# EAGLE design HydraBus_1_0_Rev1_2plus (EAGLE 7.1.0)
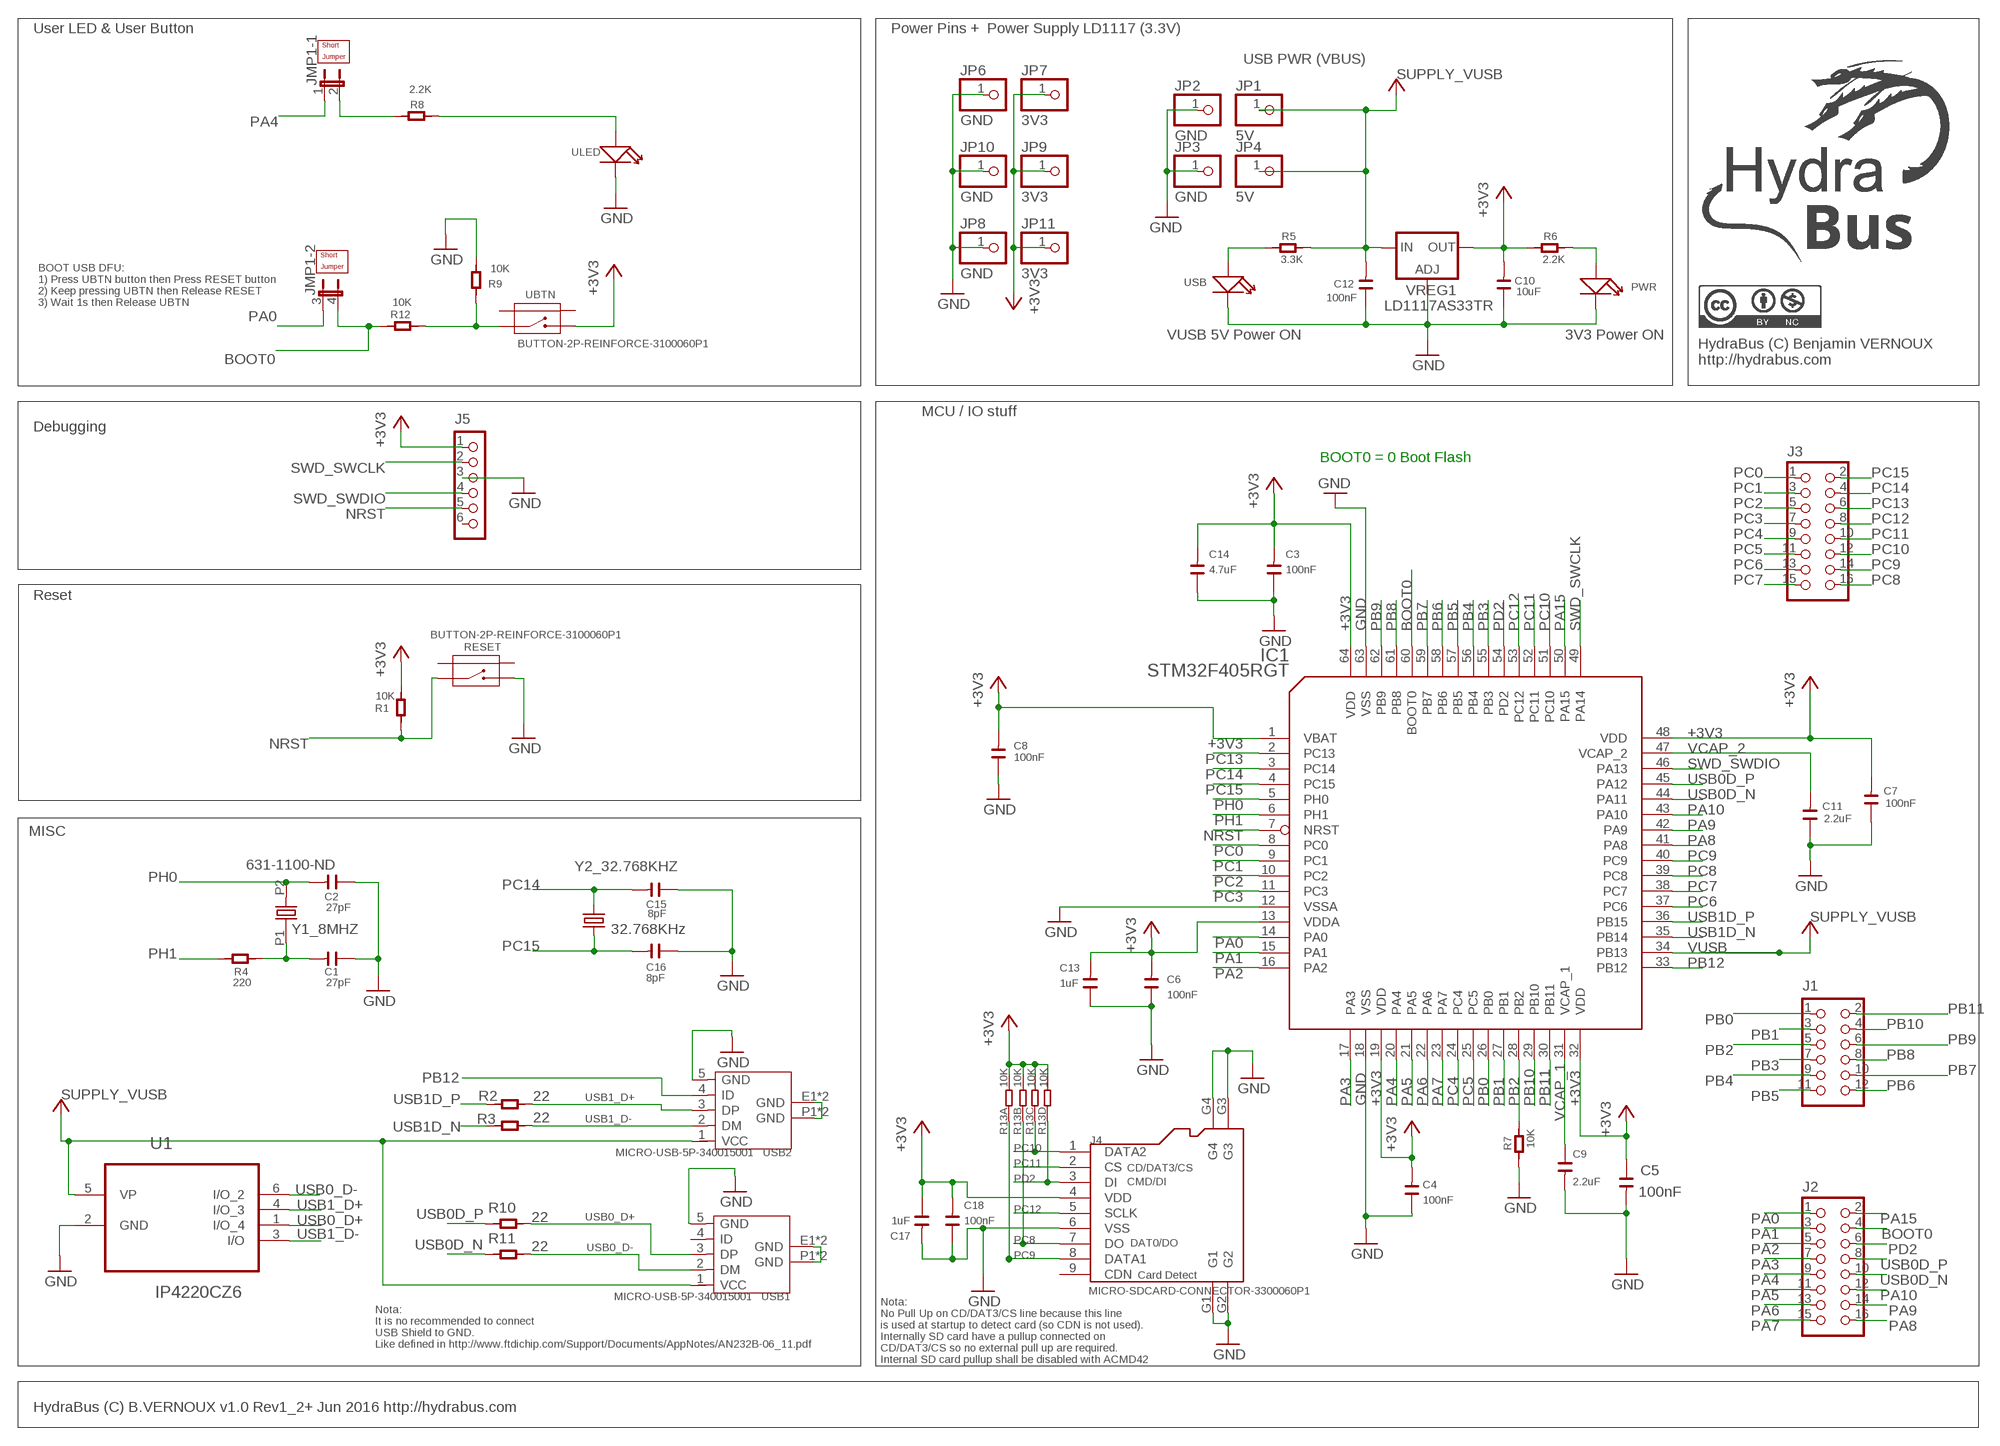
[diagram p0: schematic, sheet 1]

## Parts
C1  27pF  C-0603  [C0603]
C2  27pF  C-0603  [C0603]
C3  100nF  C-0603  [C0603]
C4  100nF  C-0603  [C0603]
C5  100nF  C-0603  [C0603]
C6  100nF  C-0603  [C0603]
C7  100nF  C-0603  [C0603]
C8  100nF  C-0603  [C0603]
C9  2.2uF  C-0603  [C0603]
C10  10uF  C-0805  [C0805]
C11  2.2uF  C-0603  [C0603]
C12  100nF  C-0603  [C0603]
C13  1uF  C-0603  [C0603]
C14  4.7uF  C-0603  [C0603]
C15  8pF  C-0603  [C0603]
C16  8pF  C-0603  [C0603]
C17  1uF  C-0603  [C0603]
C18  100nF  C-0603  [C0603]
IC1  STM32F405RGT  [LQFP64]
J1  CON_HEADER_2X06  [M2X6]
J2  CON_HEADER_2X08  [M2X8]
J3  CON_HEADER_2X08  [M2X8]
J4  MICRO-SDCARD-CONNECTOR-3300060P1  [9P-SMD-W-RING]
J5  CON_HEADER_1X06-PTH  [M1X6]
JMP1  JP2QE  [JP2Q]
JMP_UBTN  SHORT-JUMPER-2P-3460440P1  [2P-2.54]
JMP_ULED  SHORT-JUMPER-2P-3460440P1  [2P-2.54]
JP1  5V  PINHD-1X1  [1X01]
JP2  GND  PINHD-1X1  [1X01]
JP3  GND  PINHD-1X1  [1X01]
JP4  5V  PINHD-1X1  [1X01]
JP6  GND  PINHD-1X1  [1X01]
JP7  3V3  PINHD-1X1  [1X01]
JP8  GND  PINHD-1X1  [1X01]
JP9  3V3  PINHD-1X1  [1X01]
JP10  GND  PINHD-1X1  [1X01]
JP11  3V3  PINHD-1X1  [1X01]
PWR  LED  [LED0603]
R1  10K  R-0603  [R0603]
R2  22  R-0603  [R0603]
R3  22  R-0603  [R0603]
R4  220  R-0603  [R0603]
R5  3.3K  R-0603  [R0603]
R6  2.2K  R-0603  [R0603]
R7  10K  R-0603  [R0603]
R8  2.2K  R-0603  [R0603]
R9  10K  R-0603  [R0603]
R10  22  R-0603  [R0603]
R11  22  R-0603  [R0603]
R12  10K  R-0603  [R0603]
R13  10K  R-4R  [R1206-8]
RESET  BUTTON-2P-REINFORCE-3100060P1  [4P-SMD-7.0X3.5X3.5H-90D]
U1  IP4220CZ6  [SOT95P275X110-6N]
UBTN  BUTTON-2P-REINFORCE-3100060P1  [4P-SMD-7.0X3.5X3.5H-90D]
ULED  LED  [LED0603]
USB  LED  [LED0603]
USB1  MICRO-USB-5P-340015001  [B-SMD-5P]
USB2  MICRO-USB-5P-340015001  [B-SMD-5P]
VREG1  LD1117AS33TR  LD117AS33TR  [SOT223]
Y1_8MHZ  631-1100-ND  OSC-XTAL-HC-49U-PTH  [HC-49U-PTH]
Y2_32.768KHZ  32.768KHz  CRYSTALTC38H  [TC38H]

## Nets
+3V3 [VDD]: C3.1 C4.1 C5.2 C6.1 C7.1 C8.1 C10.1 C13.1 C14.1 C17.2 C18.1 IC1.1(VBAT) IC1.13(VDDA) IC1.19(VDD) IC1.32(VDD) IC1.48(VDD) IC1.64(VDD) J4.4(VDD) J5.1 JP7.1 JP9.1 JP11.1 R1.2 R6.2 R13.5 R13.6 R13.7 R13.8 UBTN.2 VREG1.4(OUT)
BOOT0: IC1.60(BOOT0) J2.4 JMP1.4 R12.2
GND: C1.2 C2.2 C3.2 C4.2 C5.1 C6.2 C7.2 C8.2 C9.1 C10.2 C11.2 C12.2 C13.2 C14.2 C15.2 C16.2 C17.1 C18.2 IC1.12(VSSA) IC1.18(VSS) IC1.63(VSS) J4.6(VSS) J4.G1 J4.G2 J4.G3 J4.G4 J5.3 JP2.1 JP3.1 JP6.1 JP8.1 JP10.1 PWR.- R7.2 R9.2 RESET.2 U1.2(GND) ULED.- USB1.5(GND) USB2.5(GND) USB.- VREG1.1(ADJ)
N$1: C1.1 R4.1 Y1_8MHZ.P1
N$4: JMP1.2 R8.2
N$6: R9.1 R12.1 UBTN.1
N$7: R8.1 ULED.+
N$10: USB2.E1(GND) USB2.E2(GND) USB2.P1(GND) USB2.P2(GND)
N$11: USB1.E1(GND) USB1.E2(GND) USB1.P1(GND) USB1.P2(GND)
N$32: R5.2 USB.+
N$33: PWR.+ R6.1
NRST: IC1.7(NRST) J5.5 R1.1 RESET.1
PA0: IC1.14(PA0) J2.1 JMP1.3
PA1: IC1.15(PA1) J2.3
PA2: IC1.16(PA2) J2.5
PA3: IC1.17(PA3) J2.7
PA4: IC1.20(PA4) J2.9 JMP1.1
PA5: IC1.21(PA5) J2.11
PA6: IC1.22(PA6) J2.13
PA7: IC1.23(PA7) J2.15
PA8: IC1.41(PA8) J2.16
PA9: IC1.42(PA9) J2.14
PA10: IC1.43(PA10) J2.12
PA15: IC1.50(PA15) J2.2
PB0: IC1.26(PB0) J1.1
PB1: IC1.27(PB1) J1.3
PB2: IC1.28(PB2) J1.5 R7.1
PB3: IC1.55(PB3) J1.7
PB4: IC1.56(PB4) J1.9
PB5: IC1.57(PB5) J1.11
PB6: IC1.58(PB6) J1.12
PB7: IC1.59(PB7) J1.10
PB8: IC1.61(PB8) J1.8
PB9: IC1.62(PB9) J1.6
PB10: IC1.29(PB10) J1.4
PB11: IC1.30(PB11) J1.2
PB12: IC1.33(PB12) USB2.4(ID)
PC0: IC1.8(PC0) J3.1
PC1: IC1.9(PC1) J3.3
PC2: IC1.10(PC2) J3.5
PC3: IC1.11(PC3) J3.7
PC4: IC1.24(PC4) J3.9
PC5: IC1.25(PC5) J3.11
PC6: IC1.37(PC6) J3.13
PC7: IC1.38(PC7) J3.15
PC8: IC1.39(PC8) J3.16 J4.7(DO) R13.2
PC9: IC1.40(PC9) J3.14 J4.8(DATA1) R13.1
PC10: IC1.51(PC10) J3.12 J4.1(DATA2) R13.3
PC11: IC1.52(PC11) J3.10 J4.2(CS)
PC12: IC1.53(PC12) J3.8 J4.5(SCLK)
PC13: IC1.2(PC13) J3.6
PC14: C15.1 IC1.3(PC14) J3.4 Y2_32.768KHZ.2
PC15: C16.1 IC1.4(PC15) J3.2 Y2_32.768KHZ.1
PD2: IC1.54(PD2) J2.6 J4.3(DI) R13.4
PH0: C2.1 IC1.5(PH0) Y1_8MHZ.P2
PH1: IC1.6(PH1) R4.2
SWD_SWCLK: IC1.49(PA14) J5.2
SWD_SWDIO: IC1.46(PA13) J5.4
USB0_D+: R10.1 U1.1(I/O_4) USB1.3(DP)
USB0_D-: R11.1 U1.6(I/O_2) USB1.2(DM)
USB0D_N: IC1.44(PA11) J2.10 R11.2
USB0D_P: IC1.45(PA12) J2.8 R10.2
USB1_D+: R2.1 U1.4(I/O_3) USB2.3(DP)
USB1_D-: R3.1 U1.3(I/O) USB2.2(DM)
USB1D_N: IC1.35(PB14) R3.2
USB1D_P: IC1.36(PB15) R2.2
VCAP_1: C9.2 IC1.31(VCAP_1)
VCAP_2: C11.1 IC1.47(VCAP_2)
VUSB [POWER]: C12.1 IC1.34(PB13) JP1.1 JP4.1 R5.1 U1.5(VP) USB1.1(VCC) USB2.1(VCC) VREG1.3(IN) ; supply symbol labelled SUPPLY_VUSB
Unconnected: J4.9(CDN) J5.6 RESET.S1 RESET.S2 UBTN.S1 UBTN.S2 USB1.4(ID)

## Notes on the sheet
- User LED & User Button | Power Pins +  Power Supply LD1117 (3.3V)
- USB PWR (VBUS)
- BOOT USB DFU:
  1) Press UBTN button then Press RESET button
  2) Keep pressing UBTN then Release RESET
  3) Wait 1s then Release UBTN
- VUSB 5V Power ON | 3V3 Power ON
- HydraBus (C) Benjamin VERNOUX
  http://hydrabus.com
- MCU / IO stuff
- Debugging
- BOOT0 = 0 Boot Flash
- Reset
- MISC
- CD/DAT3/CS
- CMD/DI
- DAT0/DO
- Card Detect
- Nota:
  It is no recommended to connect
  USB Shield to GND.
  Like defined in http://www.ftdichip.com/Support/Documents/AppNotes/AN232B-06_11.pdf
- Nota:
  No Pull Up on CD/DAT3/CS line because this line
  is used at startup to detect card (so CDN is not used).
  Internally SD card have a pullup connected on
  CD/DAT3/CS so no external pull up are required.
  Internal SD card pullup shall be disabled with ACMD42
- HydraBus (C) B.VERNOUX v1.0 Rev1_2+ Jun 2016 http://hydrabus.com

## Library data of the parts
C1-C18 = OPL:C*
IC1 = 0ben:STM32F405R*T: STM32F405R*T ARM Cortex-M4 32b MCU+FPU, 210DMIPS, up to 1MB Flash/192+4KB RAM, USB OTG HS/FS, 17 TIMs, 3 ADCs, 15 comm.
J1 = hydrabus:CON_HEADER_2X06: 2x5 Pin header
J2 J3 = hydrabus:CON_HEADER_2X08
J4 = OPL:MICRO-SDCARD-CONNECTOR: Micro SD Card
J5 = hydrabus:CON_HEADER_1X06
JMP1 = jumper:JP2QE: JUMPER
JMP_UBTN JMP_ULED = OPL:SHORT-JUMPER-2P
JP1-JP4 JP6-JP11 = pinhead:PINHD-1X1: PIN HEADER
PWR ULED USB = OPL:LED*: LED
R1 R9 = OPL:R*; OPL_REF: 0010170P1 10K-5%-1/10W R0603
R2 R3 R10 R11 = OPL:R*; OPL: 0010010P1 RC0603JR-0722RL SMD RES 22R-5%-1/10W
R4-R8 R12 = OPL:R*
R13 = OPL:R-4R*: Resistor Array; OPL: 0040070P1 SMD RES ARRAY 10K OHM 4 RES 1206
RESET UBTN = OPL:BUTTON-2P-REINFORCE: TS-1188E http://www.best-dz.com/?thread-374-2.html SMD Button
U1 = 0ben:IP4220CZ6: Dual Schmitt-Trigger Inverter; MPN: IP4220CZ6; OC_FARNELL: 1506629; OC_MOUSER: 771-IP4220CZ6-T/R; OC_NEWARK: 61M6815; PACKAGE: SSOT-6; SUPPLIER: NXP
USB1 USB2 = OPL:MICRO-USB-5P: ST-USB-001E：MICRO USB B SMD R/A
VREG1 = v-reg:LD117A?*: Low drop fixed and adjustable positive voltage regulators 1 A Source: http://www.st.com/stonline/products/literature/ds/7194/ld1117axx.pdf; OPL_REF: 1310190P1 CJT1117-3.3 SOT223
Y1_8MHZ = dp_devices:OSC-XTAL
Y2_32.768KHZ = SparkFun:CRYSTAL: Crystals Various standard crystals. Proven footprints. Spark Fun Electronics SKU : COM-00534

## Net classes
0 default: width 0.203 mm, drill 0.33 mm, clearance 0.152 mm
1 POWER: width 0.203 mm, drill 0.33 mm, clearance 0.152 mm
2 VDD: width 0.254 mm, drill 0.33 mm, clearance 0.152 mm

## Board
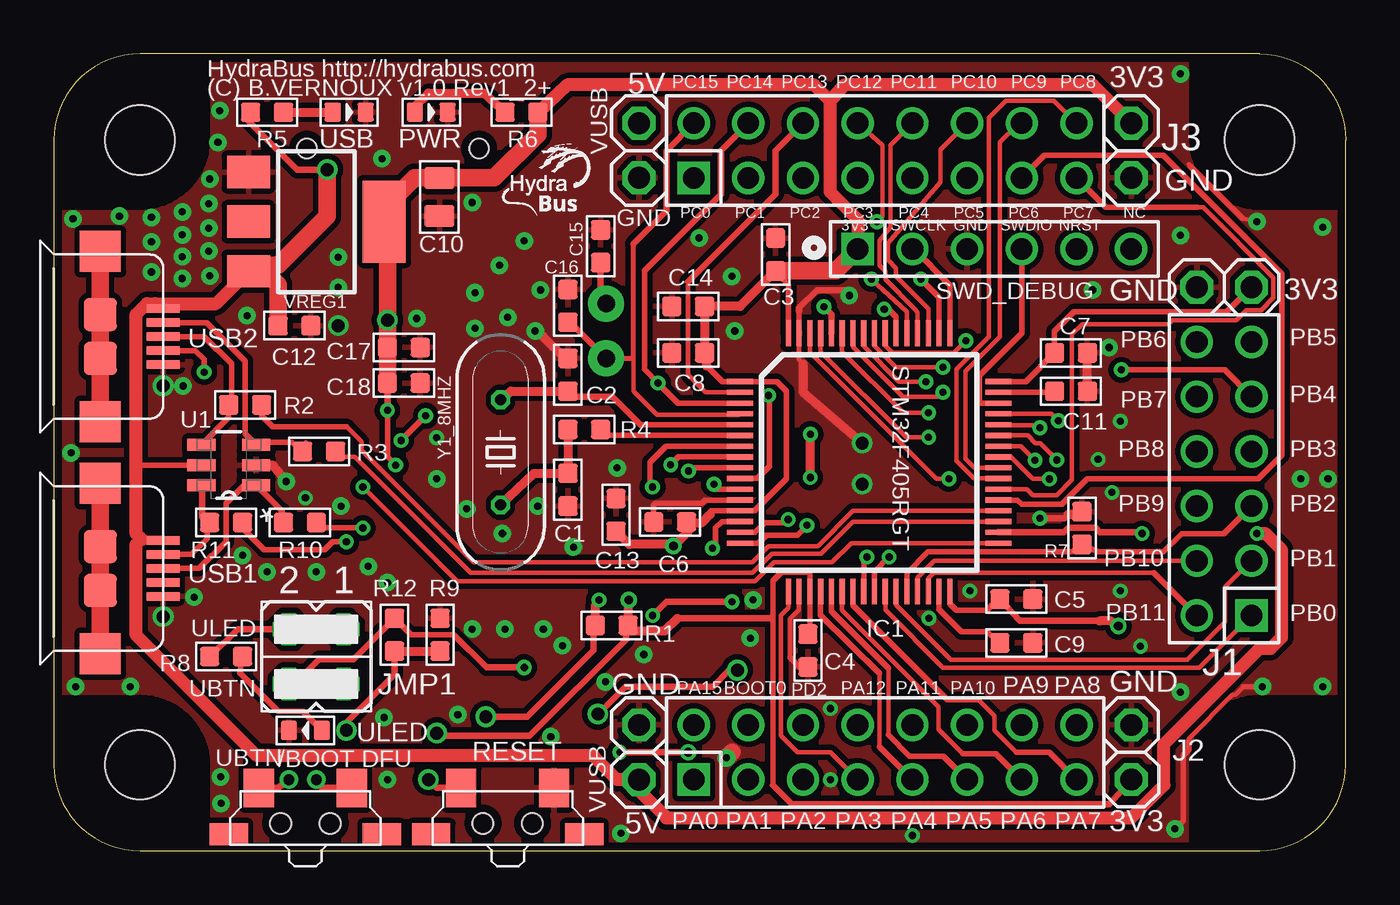
[diagram p1: board, top side]
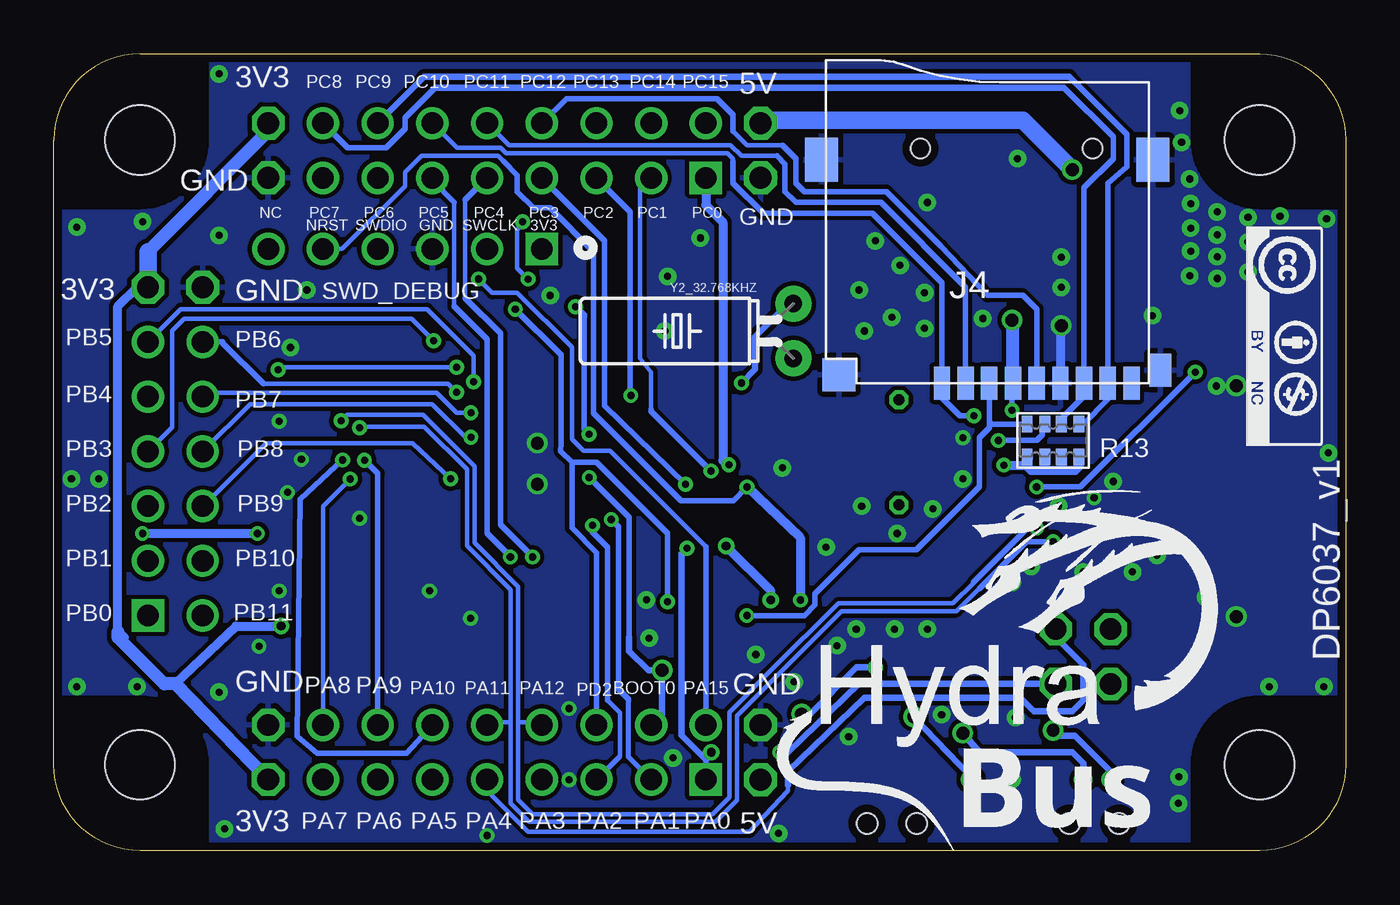
[diagram p2: board, bottom side, seen from below]

Size 60 x 37 mm. Coordinates in mm from the lower left corner, seen from the top.
Copper layers (1*16): Top 0.0356mm / dielectric 1.5011mm / Bottom 0.0356mm
Design rules "oshpark-2layer": minimum track width 6mil, minimum drill 13mil, track to track 6mil, track to pad 6mil, pad to pad 6mil, via to via 6mil, smd to smd 6mil, copper to edge 15mil, drill to drill 6mil, minimum pad ring 7mil, minimum via ring 7mil, stop-mask expansion 2.5mil, vias tented up to drill 0mil, thermal gap 10mil

### Footprints (pad centres in the part's own frame; a part is rotated, then mirrored left to right if it is on the bottom)
C0603 = smd 0.889 x 0.889: 1 -0.762,0; 2 0.762,0
C0805 = smd 1.016 x 1.397: 1 -0.889,0; 2 0.889,0
LQFP64 = smd 0.24 x 1.2: 1 -3.75,-6; 2 -3.25,-6; 3 -2.75,-6; 4 -2.25,-6; 5 -1.75,-6; 6 -1.25,-6; 7 -0.75,-6; 8 -0.25,-6; 9 0.25,-6; 10 0.75,-6; 11 1.25,-6; 12 1.75,-6; 13 2.25,-6; 14 2.75,-6; 15 3.25,-6; 16 3.75,-6; 33 3.75,6; 34 3.25,6; 35 2.75,6; 36 2.25,6; 37 1.75,6; 38 1.25,6; 39 0.75,6; 40 0.25,6; 41 -0.25,6; 42 -0.75,6; 43 -1.25,6; 44 -1.75,6; 45 -2.25,6; 46 -2.75,6; 47 -3.25,6; 48 -3.75,6 | smd 1.2 x 0.24: 17 6,-3.75; 18 6,-3.25; 19 6,-2.75; 20 6,-2.25; 21 6,-1.75; 22 6,-1.25; 23 6,-0.75; 24 6,-0.25; 25 6,0.25; 26 6,0.75; 27 6,1.25; 28 6,1.75; 29 6,2.25; 30 6,2.75; 31 6,3.25; 32 6,3.75; 49 -6,3.75; 50 -6,3.25; 51 -6,2.75; 52 -6,2.25; 53 -6,1.75; 54 -6,1.25; 55 -6,0.75; 56 -6,0.25; 57 -6,-0.25; 58 -6,-0.75; 59 -6,-1.25; 60 -6,-1.75; 61 -6,-2.25; 62 -6,-2.75; 63 -6,-3.25; 64 -6,-3.75
M2X6 = drill 1 square: 1 -6.35,-1.27 | drill 1: 2 -6.35,1.27; 3 -3.81,-1.27; 4 -3.81,1.27; 5 -1.27,-1.27; 6 -1.27,1.27; 7 1.27,-1.27; 8 1.27,1.27; 9 3.81,-1.27; 10 3.81,1.27; 11 6.35,-1.27; 12 6.35,1.27
M2X8 = drill 1 square: 1 -8.89,-1.27 | drill 1: 2 -8.89,1.27; 3 -6.35,-1.27; 4 -6.35,1.27; 5 -3.81,-1.27; 6 -3.81,1.27; 7 -1.27,-1.27; 8 -1.27,1.27; 9 1.27,-1.27; 10 1.27,1.27; 11 3.81,-1.27; 12 3.81,1.27; 13 6.35,-1.27; 14 6.35,1.27; 15 8.89,-1.27; 16 8.89,1.27
9P-SMD-W-RING = smd 1.524 x 0.762: 1 -7.493,2.114; 2 -7.493,1.014; 3 -7.493,-0.086; 4 -7.493,-1.186; 5 -7.493,-2.286; 6 -7.493,-3.386; 7 -7.493,-4.486; 8 -7.493,-5.586; 9 -7.493,-6.686 | smd 1.524 x 1.016: G1 -6.893,-8.032 | smd 2.032 x 1.524: G2 2.88,-7.686; G3 2.88,7.714 | smd 1.524 x 1.524: G4 -7.101,6.895 | hole 0.889: 3.407,-4.886; 3.407,3.114
M1X6 = drill 1 square: 1 0,0 | drill 1: 2 2.54,0; 3 5.08,0; 4 7.62,0; 5 10.16,0; 6 12.7,0
JP2Q = drill 1 octagon: 1 -1.27,-1.27; 2 1.27,-1.27; 3 -1.27,1.27; 4 1.27,1.27
1X01 = drill 1.016 octagon: 1 0,0
LED0603 = smd 0.762 x 0.889: + -0.762,0; - 0.762,0
R0603 = smd 0.889 x 0.889: 1 -0.762,0; 2 0.762,0
R1206-8 = smd 0.508 x 0.762: 1 -1.206,-0.762; 2 -0.381,-0.762; 3 0.381,-0.762; 4 1.206,-0.762; 5 1.206,0.762; 6 0.381,0.762; 7 -0.381,0.762; 8 -1.206,0.762
4P-SMD-7.0X3.5X3.5H-90D = smd 1.397 x 1.778: 1 -2.159,1.651; 2 2.159,1.651 | smd 1.778 x 1.016: S1 -3.556,-0.508; S2 3.556,-0.508 | hole 0.95: -1.15,0; 1.15,0
SOT95P275X110-6N = smd 1.321 x 0.559: 1 -1.27,0.94; 2 -1.27,0; 3 -1.27,-0.94; 4 1.27,-0.94; 5 1.27,0; 6 1.27,0.94
DP6037_V1 = hole 3.2: 4,4; 56,4; 56,33; 4,33
B-SMD-5P = smd 0.38 x 1.52: 1 -1.3,2.54; 2 -0.65,2.54; 3 0,2.54; 4 0.65,2.54; 5 1.3,2.54 | smd 1.524 x 1.524: E1 -1.016,-0.381; E2 1.016,-0.381 | smd 1.9 x 1.9: P1 -3.95,-0.381; P2 3.95,-0.381
SOT223 = smd 1.5 x 2: 1 -2.3,-3.15; 2 0,-3.15; 3 2.3,-3.15 | smd 3.8 x 2: 4 0,3.15
HC-49U-PTH = drill 0.508 octagon: P1 -2.44,0; P2 2.44,0
TC38H = drill 0.813 pad 1.676: 1 -1.27,0; 2 1.27,0

### Placement (x,y rotation side)
C1  23.88,16.76 270 top
C2  23.88,22.1 90 top
C3  33.53,27.69 90 top
C4  35.03,9.3 270 top
C5  44.7,11.68 180 top
C6  28.63,15.27 180 top
C7  47.24,23.11 0 top
C8  29.46,23.11 180 top
C9  44.7,9.65 180 top
C10  17.91,30.35 270 top
C11  47.24,21.34 0 top
C12  11.18,24.38 0 top
C13  26.11,15.6 90 top
C14  29.46,25.27 180 top
C15  25.4,28.07 90 top
C16  23.88,25.3 90 top
C17  16.26,23.37 180 top
C18  16.26,21.72 0 top
IC1  37.86,18.03 270 top
J1  54.36,17.27 90 top
J2  38.61,4.57 0 top
J3  38.61,32.51 0 top
J4  16.64,29.2 90 bottom
J5  37.34,27.94 0 top
JMP1  12.19,9.02 180 top
JMP_UBTN  12.19,7.75 0 top
JMP_ULED  12.19,10.29 0 top
JP1  27.18,33.78 180 top
JP2  27.18,31.24 0 top
JP3  27.18,5.84 0 top
JP4  27.18,3.3 0 top
JP6  53.09,26.16 270 top
JP7  50.04,3.31 270 top
JP8  50.04,31.24 270 top
JP9  50.04,33.78 270 top
JP10  50.04,5.84 270 top
JP11  55.63,26.16 270 top
PWR  17.53,34.29 0 top
R1  25.91,10.46 0 top
R2  8.89,20.7 0 top
R3  12.32,18.54 0 top
R4  24.64,19.56 0 top
R5  9.91,34.29 0 top
R6  21.72,34.29 0 top
R7  47.75,14.99 90 top
R8  8,9.02 180 top
R9  17.94,10.03 90 top
R10  11.43,15.24 0 top
R11  8,15.24 0 top
R12  15.82,10.03 90 top
R13  13.59,19.05 180 bottom
RESET  21.08,1.27 0 top
U1  8.13,17.91 180 top
U$1  [DP6037_V1]  0,0 0 top
UBTN  11.68,1.27 0 top
ULED  11.68,5.59 180 top
USB  13.72,34.29 0 top
USB1  2.54,13.11 270 top
USB2  2.54,23.88 270 top
VREG1  12.19,29.21 270 top
Y1_8MHZ  20.75,18.5 90 top
Y2_32.768KHZ  25.65,24.13 90 bottom

### Tracks (layer width: path | path; a pad name or v marks a point on that pad's centre or on a via)
+3V3  (via drill 0.33, 0.41 pad 0.71, 0.5, 0.6)
  Top 0.254: IC1.1 31.91,21.78 | 33.4,3.05 33.4,11 | 33.4,11 33.4,12.55 33.79,12.94 35.07,12.94 35.12,12.89 IC1.19 35.12,10.23 C4.1 | 33.35,10.79 33.4,11 | 30.54,23.11 C8.1 | 33.78,26.92 33.78,27.18 C3.1 34.12,26.25 IC1.64 | 30.52,15.78 IC1.13 32.55,15.78 34.04,17.27 34.04,21.34 33.59,21.78 IC1.1 | 29.5,15.24 C6.1 | IC1.32 41.62,11.47 41.91,11.18 43.35,11.18 43.85,11.68 C5.2 43.85,11.52 | IC1.1 31.05,21.78 30.99,21.84 | IC1.48 45.15,21.78 C7.1 46.48,24.13 47.37,25.02 54.48,25.02 JP11.1 | 25.89,14.75 26.15,14.75 | 28.7,14.22 v28.78,14.15 | v15.49,20.45 15.49,18.29 v15.88,17.91 | 30.48,15.62 30.48,15.75 30.61,15.75
  Top 0.305: JP7.1 49.02,2.16 34.29,2.16 33.4,3.05 | C13.1 25.89,14.75 | 29.55,15.45 C6.1 29.48,14.85 | 55.52,26.05 JP11.1 | 48.57,10.67 44.87,10.67 C5.2 | C8.1 30.31,22.77 | 30.31,22.52 30.99,21.84 | UBTN.2 12.45,2.92 v12.19,3.3 | 26.57,10.21 26.57,9.81 22.1,5.33 17.91,5.33 v17.78,5.46 | 28.96,10.79 33.35,10.79 | 15.49,21.59 v15.49,20.45
  Top 0.406: v28.78,14.15 29.48,14.85 | 30.31,22.52 C8.1 C14.1 | v26.7,11.64 26.67,11.54 R1.2 26.57,10.21 28.37,10.21 28.96,10.79 | v49.44,10.43 49.08,10.67 48.57,10.67 | 30.23,25.31 C14.1 | 15.37,29.18 VREG1.4 | C3.1 31.88,25.27 C14.1 | 28.7,14.22 26.72,14.22 C13.1 | 29.5,15.24 30.1,15.24 30.48,15.62
  Top 0.61: 36.07,34.81 36.71,35.56 48.26,35.56 JP9.1 | 36.07,34.81 36.07,30.57 37.34,29.3 J5.1 | 36.07,34.81 36.05,34.81 35.31,35.56 23.84,35.56 R6.2
  Top 0.762: 15.24,29.72 15.24,29.31 VREG1.4
  Top 0.813: 15.24,29.72 16.76,31.24 C10.1 20.45,31.24 22.48,33.27 R6.2 | C3.1 36.32,26.92 J5.1 | 15.49,21.59 C18.1 C17.2 v15.49,24.64 15.49,29.06 VREG1.4
  Bottom 0.254: v15.49,20.45 15.49,21.67 J4.4 | 57.02,10.16 56.9,10.16 56.64,9.91
  Bottom 0.305: v12.19,3.3 12.19,4.06 12.7,4.57 17.02,4.57 v17.78,5.46
  Bottom 0.406: JP11.1 56.13,26.16 57.02,25.27 57.02,10.16 | 54.36,7.75 51.54,10.43 v49.44,10.43 | v15.88,17.91 14.86,17.91 14.73,17.78 | v26.7,11.64 26.7,12.07 v28.78,14.15 | R13.8 12.38,17.84 12.57,17.65 13.08,17.65 13.21,17.78 | R13.7 13.21,17.78 | 14.73,17.78 14.61,17.65 13.97,17.65 R13.6 13.97,17.78 13.84,17.65 13.21,17.65 13.21,17.78 | 14.73,17.78 14.73,18.22 R13.5
  Bottom 0.61: JP7.1 54.36,7.75 54.86,7.75 57.02,9.91 57.02,10.16 | 50.04,33.4 55.63,27.81 | J4.4 15.45,24.72 v15.49,24.64
  Bottom 0.813: JP9.1 50.04,33.4 | 55.63,27.81 JP11.1
BOOT0  (via drill 0.33 pad 0.64, 0.36, 0.6)
  Top 0.254: R12.2 16.59,10.03 18.57,10.03 20.1,8.51
  Top 0.305: IC1.60 36.12,24.91 v35.77,25.26 | v31.75,8.38 31.37,8.38 30.61,7.62 26.54,7.62 v25.27,6.35 | v21.84,8.51 20.1,8.51 | JMP1.4 11.18,7.75 12.32,8.89 13.92,8.89 R12.2
  Top 0.406: v35.13,17.33 v35.13,19.34 v35.14,19.34
  Bottom 0.254: v35.14,19.34 35.38,19.59 35.38,24.79 | v35.13,17.33 33.27,15.47 33.27,9.91
  Bottom 0.305: 35.38,24.79 35.38,24.88 v35.77,25.26 | v21.84,8.51 22.73,8.51 24.89,6.35 v25.27,6.35 | J2.4 31.75,6.35 v31.75,8.38 32.38,8.38 33.27,9.27 33.27,9.91
GND  (via drill 0.33 pad 0.64, 0.33 pad 0.81, 0.6 pad 0.81)
  Top 0.203: IC1.18 34.62,11.2 34.19,10.77 34.19,8.99 | IC1.63 34.62,22.79 34.8,22.61 | C4.2 34.73,8.45 | v55.88,29.21 55.19,29.36 | 52.78,31.77 52.83,31.75 52.7,31.88 | 52.7,5.08 52.7,5.21 54.74,7.24 54.86,7.24 55.24,7.62
  Top 0.254: 34.73,8.45 34.19,8.99 | IC1.63 34.62,25.05 | 55.19,29.36 52.78,31.77 | v56.13,7.62 55.24,7.62 | 52.7,5.08 52.7,4.7 52.45,4.45 52.45,1.4 v52.07,1.02 | C6.2 27.86,16.05 27.94,16.13 30.1,16.13 30.25,16.28 IC1.12
  Top 0.305: v45.8,15.44 46.94,15.44 47.12,15.62 | 34.62,25.05 34.62,25.22 35.43,26.04 36.95,26.04 v36.95,25.78
  Top 0.406: 34.8,22.61 34.8,21.3 v37.55,18.93 | 48.09,23.03 C7.2 C11.2 | 10.16,17.91 v10.79,17.14 | C2.2 23.75,22.86 22.73,23.88 | 47.12,15.62 47.62,15.62 R7.2
  Top 0.813: v31.24,4.32 31.5,4.57
  Bottom 0.406: v13.21,24.38 13.25,24.38 J4.6
  other vias: 52.32,7.37 49.01,23.37 3.56,7.62 5.08,10.87 0.89,29.34 48.5,18.17 27.4,9.11 58.93,28.96 19.43,30.1 26.16,17.78 58.93,7.62 7.24,31.19 49.53,12.06 29.97,28.45 31.5,26.67 52.32,28.57 36.07,6.6 22.48,16 49.15,16.64 15.24,32.13 52.32,36.07 1.02,7.62 31.62,24.13 50.47,9.5 36.07,3.3 19.43,10.29 20.95,10.29 7.62,32.89 17.78,17.27 15.49,3.3 5.08,21.59 3.05,29.46 0.8,18.48 57.91,17.27 5.97,29.67 22.61,26.04 21.08,24.77 19.18,15.88 20.83,14.73 7.75,3.43 37.55,17.02 6.52,11.77 6.01,21.58 7.2,30.05 22.73,10.29 23.62,9.53 12.19,12.95 15.49,12.45 14.61,13.21 8.76,13.72 9.91,12.95 13.34,16 19.56,24.26 19.56,25.91 20.7,27.18 21.84,28.32 22.35,24.13 59.18,17.27 49.53,19.94 39.88,0.71 26.34,0.81 11.68,16.38 32.35,9.87 48.25,26.04 42.55,12.06 40.64,10.79 17.78,19.18 32.48,11.65 25.62,7.84 23.08,5.3 18.76,6.32 15.33,6.19 7.76,2.2 24.13,14.1 8.98,24.84 7.71,34.37 16.85,24.71 4.53,26.87 4.53,28.27 4.53,29.41 13.21,27.56 13.21,26.16 7.2,28.91 5.97,28.6 5.97,27.58 7.2,27.84 5.97,26.57 7.24,26.7
  pour Top (isolate 0.254): -1.78,37.34 60.45,37.34 60.45,-1.78 -1.78,-1.78
  pour Bottom (isolate 0.203): -2.03,37.59 60.96,37.59 60.96,-2.03 -2.03,-2.03
N$1
  Top 0.305: 23.79,17.7 C1.1
  Top 0.406: R4.1 C1.1 22.3,17.53 Y1_8MHZ.P1
N$4
  Top 0.305: JMP1.2 8.55,10.29 R8.2
N$6  (via drill 0.5, 0.6)
  Top 0.305: R12.1 15.82,8.2 13.59,5.97 v13.59,5.59 | UBTN.1 10.41,2.92 v10.92,3.3
  Top 0.406: R12.1 R9.1
  Bottom 0.305: v10.92,3.3 10.92,3.68 12.57,5.33 13.34,5.33 v13.59,5.59
N$7
  Top 0.254: R8.1 8.64,8.26 10.41,6.48 11.56,6.48 ULED.+
N$10
  Top 0.813: USB2.P2 USB2.E2 USB2.E1 USB2.P1
N$11
  Top 0.813: USB1.P2 USB1.E2 USB1.E1 USB1.P1
N$32
  Top 0.406: R5.2 USB.+
N$33
  Top 0.406: PWR.+ 16.76,34.54 17.4,35.18 19.98,35.18 R6.1
NRST  (via drill 0.33 pad 0.64, 0.6)
  Top 0.254: IC1.7 28.44,18.78 27.69,18.03 27.69,17.01 v27.81,16.89
  Top 0.305: R1.1 25.06,10.46 25.06,9.31 21.97,6.22 v20.07,6.22 | 18.54,3.3 RESET.1 17.78,2.92 v17.4,3.3
  Top 0.406: v25.32,11.64 25.15,11.36 R1.1
  Bottom 0.203: 39.12,32 39.37,32.26 42.93,32.26 43.69,31.5 43.69,30.86 46.61,27.94 J5.5
  Bottom 0.254: v27.81,16.89 28.44,16.26 30.86,16.26 34.92,20.32 34.92,27.81 36.96,29.84 37.72,29.84 38.48,30.61 38.48,31.37 39.12,32
  Bottom 0.305: v17.4,3.3 17.4,3.43 v20.07,6.22
  Bottom 0.406: v25.32,11.64 25.32,14.53 v27.81,16.89
PA0  (via drill 0.33, 0.33 pad 0.64, 0.4)
  Top 0.254: IC1.14 31.03,15.28 30.73,14.99 30.73,14.29 v30.59,14.05
  Top 0.305: v26.29,4.57 v29.46,4.57
  Bottom 0.254: 30.85,5.36 29.72,4.24 J2.1
  Bottom 0.305: v29.46,4.57 29.38,4.57 29.72,4.24 | v26.29,4.57 25.91,4.57 22.61,7.75 JMP1.3 13.34,7.75 | 30.85,5.36 30.85,13.79 v30.59,14.05
PA1  (via drill 0.33 pad 0.64)
  Top 0.254: IC1.15 32.56,14.78 33.02,15.24 33.97,15.24 v34.11,15.38
  Bottom 0.229: J2.3 33.32,4.36 33.32,6.97
  Bottom 0.254: v34.11,15.38 33.78,15.05 33.78,7.49 33.32,7.03 33.32,6.97
PA2  (via drill 0.33 pad 0.64)
  Top 0.254: IC1.16 32.72,14.28 33.1,14.66 34.53,14.66 v34.98,15.11
  Bottom 0.203: 33.71,4.39 33.71,6.41 34.29,6.99
  Bottom 0.229: J2.5 33.71,4.39
  Bottom 0.254: v34.98,15.11 34.98,14.79 34.29,14.1 34.29,6.99
PA3
  Top 0.203: J2.7 36.07,4.57 34.54,4.57 33.78,5.33 33.78,10.94 34.12,11.27 IC1.17
PA4
  Top 0.203: 38.35,8.24 38.35,4.83
  Top 0.254: IC1.20 35.62,10.93 38.35,8.24 | 38.35,4.83 J2.9
  Bottom 0.203: J2.9 39.88,2.79 37.97,0.89 27.69,0.89 25.91,2.79 25.91,3.05
  Bottom 0.305: 25.91,3.05 25.91,3.68 22.35,7.11 15.11,7.11 14.48,6.48 12.7,6.48 12.19,6.99 12.19,8.64 13.46,9.91 JMP1.1
PA5
  Top 0.203: 38.76,8.48 38.76,5.38
  Top 0.254: IC1.21 36.12,11.13 38.76,8.48 | 38.76,5.38 39.75,4.39 41.33,4.39 J2.11
PA6
  Top 0.203: IC1.22 36.62,11.16 41.1,6.68 41.1,5.64 42.23,4.51
  Top 0.254: J2.13 43.75,4.51 42.23,4.51
PA7
  Top 0.203: 42.94,7.01 43.69,6.26 43.69,5.59 44.7,4.57 | IC1.23 37.12,11.4
  Top 0.254: 42.94,7.01 41.51,7.01 37.12,11.4 | J2.15 46.23,4.57 44.7,4.57
PA8  (via drill 0.33 pad 0.64)
  Top 0.203: v46.24,17.26 46.22,17.28 45.46,17.28 44.45,18.29 IC1.41 44.34,18.28
  Bottom 0.203: J2.16 47.5,16 v46.24,17.26
PA9  (via drill 0.33 pad 0.64)
  Top 0.203: IC1.42 44.92,18.78 v45.57,18.13
  Bottom 0.254: J2.14 44.96,17.52 v45.57,18.13
PA10  (via drill 0.33 pad 0.64)
  Top 0.203: IC1.43 45.23,19.28 45.59,18.92 45.81,18.92 v46.59,18.14
  Bottom 0.254: J2.12 43.61,4.52 47.77,4.52 48.7,5.32 48.57,16.32 v46.59,18.14
PA15  (via drill 0.33 pad 0.64)
  Top 0.254: IC1.50 41.12,25.7 v40.27,26.55
  Bottom 0.203: 29.72,14.11 34.17,18.56 35.39,18.56 35.93,19.11 35.93,23.37 35.94,23.37 38.48,25.91 39.63,25.91 v40.27,26.55
  Bottom 0.254: 29.72,14.11 J2.2
PB0
  Top 0.203: IC1.26 38.62,11.18 41.3,8.49 53.2,8.49 J1.1
PB1
  Top 0.203: J1.3 54.39,12.22 54.39,10.62 52.64,8.87 41.66,8.87 39.12,11.41 IC1.27
PB2
  Top 0.203: 39.62,12.89
  Top 0.254: J1.5 54.34,14.71 52.38,14.71 51.54,13.88 48.48,13.88 R7.1 47.28,13.88 40.6,13.88 39.62,12.89 IC1.28
PB3  (via drill 0.33 pad 0.64)
  Top 0.203: IC1.55 38.62,23.45 38.95,23.12 41.81,23.12 v42.36,23.67
  Bottom 0.203: J1.7 54.51,19.66 54.51,24.14 53.94,24.7 43.39,24.7 v42.36,23.67
PB4  (via drill 0.33 pad 0.64)
  Top 0.203: IC1.56 38.12,23.44 39.1,22.45 v41.3,22.45
  Top 0.254: J1.9 54.38,22.33 v49.58,22.33
  Bottom 0.203: v49.58,22.33 49.46,22.45 v41.3,22.45
PB5  (via drill 0.33 pad 0.64)
  Top 0.203: IC1.57 37.62,23.42 39.25,21.78 v40.5,21.78
  Bottom 0.203: v40.5,21.78 40.5,22.98 42.67,25.15 54.1,25.15 J1.11
PB6  (via drill 0.33 pad 0.64)
  Top 0.203: IC1.58 37.12,23.39 39.44,21.07 41.09,21.07 v41.3,21.28
  Bottom 0.203: 50.26,21.67 41.69,21.67 v41.3,21.28
  Bottom 0.254: J1.12 52.15,23.62 52.15,23.57 50.26,21.67
PB7  (via drill 0.33 pad 0.64)
  Top 0.203: v40.63,20.33 39.46,20.33 36.62,23.18 IC1.59
  Bottom 0.203: v40.63,20.33 41.29,20.33 42.22,21.26 52.81,21.26 J1.10
PB8  (via drill 0.33 pad 0.64)
  Top 0.203: v40.63,19.2 39.59,19.2 35.62,23.18 IC1.61
  Bottom 0.203: J1.8 50.89,20.74 42.42,20.74 40.88,19.2 v40.63,19.2
PB9  (via drill 0.33 pad 0.64)
  Top 0.203: IC1.62 35.12,23.15 40.99,17.27 v41.58,17.27
  Bottom 0.203: v41.58,17.27 43.35,18.92 50.15,18.92 53.07,16 J1.6
PB10
  Top 0.203: IC1.29 40.12,12.67 40.91,13.46 J1.4
PB11
  Top 0.203: 51.09,12.91 40.87,12.91 40.62,12.66 IC1.30
  Top 0.254: J1.2 51.09,12.91
PB12  (via drill 0.33)
  Top 0.203: IC1.33 37.04,14.28 36.14,13.39 33.45,13.39 32.57,12.5 18.74,12.5 v14.35,16.89
  Top 0.254: USB2.4 6.57,23.23 6.99,22.81 v6.99,22.23
  Bottom 0.254: v6.99,22.23 12.32,16.89 v14.35,16.89
PC0  (via drill 0.33 pad 0.64)
  Top 0.254: IC1.8 29.02,18.28 v28.65,17.92
  Bottom 0.406: J3.1 29.72,29.98 28.93,29.19 28.93,18.12 v28.65,17.92
PC1  (via drill 0.33 pad 0.64)
  Top 0.254: IC1.9 29.63,17.78 v29.48,17.63
  Bottom 0.203: 32.26,20.49 32.26,22.23 32.77,22.86 32.77,30.73 J3.3
  Bottom 0.254: 32.26,20.49 32.26,20.41 v29.48,17.63
PC2  (via drill 0.33 pad 0.64)
  Top 0.254: v33.2,21.14 33.23,21.14 33.24,21.09 33.24,17.84 32.68,17.28 IC1.10
  Bottom 0.254: 33.23,21.14 33.23,29.67 34.42,30.86
  Bottom 0.406: J3.5 34.42,30.86 | 33.23,21.14 v33.2,21.14
PC3  (via drill 0.33 pad 0.64)
  Top 0.254: v30.66,17.02 30.8,16.78 IC1.11
  Bottom 0.254: J3.7 34.42,28.32 34.42,20.95 34.42,20.65 v30.66,17.02
PC4  (via drill 0.33 pad 0.64)
  Top 0.254: IC1.24 37.62,13.49 v37.77,13.64
  Bottom 0.203: 40.89,25.65 40.89,30.23
  Bottom 0.254: v37.77,13.64 39.26,15.13 39.26,24.02 40.89,25.65 | 40.89,30.23 J3.9
PC5  (via drill 0.33 pad 0.64)
  Top 0.254: IC1.25 38.12,12.96 v38.8,13.64
  Bottom 0.203: 41.4,25.27 41.4,30.12
  Bottom 0.254: v38.8,13.64 v38.8,13.65 39.88,14.73 39.88,23.75 41.4,25.27 | J3.11 42.42,31.13 41.4,30.12
PC6
  Top 0.254: J3.13 46,32.28 51.54,32.28 57.03,26.79 57.03,18.37 55.93,17.27 48.01,17.27 46.81,16.08 44.95,16.08 44.74,16.28 IC1.37
PC7
  Top 0.203: IC1.38 45.19,16.78 45.47,16.51 46.58,16.51 47.29,17.21 47.29,23.97 47.77,24.46 51.76,24.46 51.94,24.64 54.92,24.64 55.39,25.1 56.07,25.1 56.64,25.67 56.64,26.61 53.38,29.87 53.11,29.87
  Top 0.254: J3.15 48.86,29.88 52.85,29.88 53.11,29.87
PC8
  Top 0.203: IC1.39 42.74,17.28 41.91,18.11 41.91,22.36 43.43,23.88 43.43,34.03 44.23,34.83 46.45,34.83 J3.16
  Bottom 0.254: 13.08,35.43 10.79,33.15 10.79,32.13 12.15,30.77 J4.7 12.19,21.68 12.19,21.08 13.21,20.07 R13.2 | 42.29,35.43 43.69,34.04 43.69,33.53 44.58,32.64 46.35,32.64 J3.16
  Bottom 0.305: 13.08,35.43 42.29,35.43
PC9
  Top 0.203: IC1.40 42.76,17.78 42.33,18.21 42.33,22.27 43.94,23.88 43.94,32.89 44.83,33.78 J3.14
  Bottom 0.254: 12.83,35.94 10.16,33.27 10.16,31.75 11.05,30.99 J4.8 11.05,20.95 12.19,19.81 R13.1 | 42.8,35.94 J3.14
  Bottom 0.305: 12.83,35.94 42.8,35.94
PC10  (via drill 0.33)
  Top 0.203: J3.12 41.19,32.55 41.19,31.04 38.73,28.21 38.73,27.43 39.12,27.05 39.12,26.67 40.62,25.17 IC1.51
  Top 0.254: v16.13,19.05 v17.27,20.19
  Bottom 0.203: 28.45,32 28.45,32.13 28.7,32.38 38.99,32.38 39.24,32.64 41.27,32.64 J3.12
  Bottom 0.254: 28.45,32 28.45,30.99 27.05,29.59 21.97,29.59 18.75,26.37 J4.1 18.8,21.67 18.8,21.08 17.91,20.19 v17.27,20.19 | R13.3 14.1,19.68 14.1,19.3 14.35,19.05 v16.13,19.05
PC11
  Top 0.203: J3.10 38.86,32.77 38.86,28.96 38.35,28.32 38.35,27.18 38.61,26.92 38.61,26.54 40.01,25.15 40.12,25 IC1.52
  Bottom 0.203: 26.42,32.26 28.07,32.26 28.57,32.77 38.86,32.77 J3.10
  Bottom 0.254: J4.2 17.65,26.16 21.59,30.1 25.53,30.1 26.04,30.61 26.04,31.88 26.42,32.26
PC12  (via drill 0.33)
  Top 0.203: J3.8 38.48,32.77 38.48,29.46 v38.23,29.21 | IC1.53 39.62,25.03 v37.97,26.54
  Bottom 0.203: 26.16,32.77 27.81,32.77 28.45,33.4 | v38.23,29.21 38.23,29.08 38.48,28.83 38.48,27.05 v37.97,26.54
  Bottom 0.254: 28.45,33.4 28.45,34.16 29.21,34.92 36.2,34.92 J3.8 | 26.16,32.77 25.53,32.13 25.53,30.99 25.15,30.61 21.34,30.61 18.8,28.07 16.64,25.78 14.99,25.78 14.35,25.15 J4.5
PC13
  Top 0.203: IC1.2 30.28,21.28 29.46,22.1 29.46,26.42
  Top 0.305: J3.6 33.53,32.51 33.53,30.48 29.46,26.42
PC14  (via drill 0.33)
  Top 0.254: IC1.3 29,20.78 v28.07,21.72 27.43,22.35 27.43,26.92 30.99,30.48
  Top 0.305: J3.4 30.99,32.51 30.99,30.48 | C15.1 25.4,25.65 Y2_32.768KHZ.2
  Bottom 0.305: Y2_32.768KHZ.2 25.91,25.4 27.43,23.88 27.43,22.35 v28.07,21.72
PC15
  Top 0.203: IC1.4 31.82,20.24 28.02,20.24 26.92,21.34 26.92,22.86
  Top 0.229: 26.92,28.19 26.92,22.86 Y2_32.768KHZ.1
  Top 0.305: 26.92,28.19 28.45,29.72 28.45,32.51 J3.2 | C16.1 23.85,24.66 Y2_32.768KHZ.1
PD2  (via drill 0.33, 0.33 pad 0.64)
  Top 0.254: v38.57,25.15 38.74,25.16 39.12,24.79 IC1.54
  Top 0.305: v31.5,11.56 28.45,11.56 v27.81,10.92
  Bottom 0.254: J2.6 34.8,13.84 35.94,14.99 35.94,18.03 | v27.81,10.92 25.15,10.92 24.64,11.43 24.64,11.94 22.61,13.97 19.94,13.97 17.02,16.89 17.02,19.18 16.55,19.64 16.55,19.94 | v31.5,11.56 31.5,14.73 34.8,18.03 35.94,18.03 | J4.3 16.55,19.94 | R13.4 16.42,19.81 16.55,19.94 | 35.94,18.03 36.46,18.55 36.45,18.92 36.45,23.05 36.47,23.05 v38.57,25.15
PH0
  Top 0.254: 27.25,19.78 IC1.5
  Top 0.305: 23.61,21.25 C2.1 24.13,21.08 25.96,21.08 27.25,19.78
  Top 0.406: Y1_8MHZ.P2 21.23,21.34 C2.1
PH1
  Top 0.254: IC1.6 25.76,19.28 R4.2
SWD_SWCLK
  Top 0.254: IC1.49 41.62,26.26 39.94,27.94 J5.2
SWD_SWDIO
  Top 0.254: IC1.46 42.98,20.78 42.98,22.05 44.96,24.02 J5.4
USB0_D+
  Top 0.254: USB1.3 6.76,13.11 8,14.35 8,16.13 8.89,17.02 | 10.58,15.79 U1.1
  Top 0.305: R10.1 10.58,15.79 | U1.1 8.94,16.97 8.89,17.02
USB0_D-
  Top 0.254: 6.9,16.93 U1.6 | USB1.2 6.39,13.76 7.11,14.48 7.11,15.2 R11.1
  Top 0.305: 6.9,16.93 6.9,15.49 R11.1
USB0D_N  (via drill 0.33)
  Top 0.203: IC1.44 43.89,19.76 45.67,19.76 v45.8,19.63 | R11.2 8.6,15.03
  Top 0.254: 8.6,15.03 8.72,15.03 9.78,13.97 12.57,13.97 12.95,14.35 v13.59,14.35
  Bottom 0.203: J2.10 39.67,5.97 38.79,5.97 | 38.79,5.97 38.79,12.12 40.82,14.15 40.82,17.71 42.8,19.69 45.74,19.69 v45.8,19.63 | 38.79,5.97 38.79,2.21 37.92,1.35 29.26,1.35 28.27,2.34 28.27,6.28 23.42,11.12 18.09,11.12 17.04,12.18 | 17.04,12.18 17.02,12.19 | 17,12.18 17.04,12.18
  Bottom 0.254: v13.59,14.35 14.83,14.35 17,12.18
USB0D_P  (via drill 0.33)
  Top 0.203: IC1.45 46.34,20.28 v46.66,19.96
  Top 0.254: R10.2 12.45,14.99 v14.35,14.99
  Bottom 0.203: 38.43,5.97 37.47,5.97 J2.8 | 38.43,5.97 38.43,12.27 40.46,14.3 40.46,17.85 42.85,20.24 46.38,20.24 v46.66,19.96 | 38.43,5.97 38.43,2.36 37.77,1.7 29.41,1.7 28.63,2.49 28.63,6.42 26.85,8.23 25.17,9.91 25.14,9.91 23.57,11.48 18.23,11.48 17.27,12.45 17.29,12.46
  Bottom 0.254: 17.29,12.46 14.77,14.99 v14.35,14.99
USB1_D+
  Top 0.254: USB2.3 6.99,23.88 8.26,22.61 8.26,20.92 R2.1 8.13,20.12 U1.4
USB1_D-
  Top 0.203: 11.68,18.96 R3.1
  Top 0.254: 9.51,18.96 U1.3 | U1.3 9.77,18.96 11.05,18.96 R3.1 | USB2.2 7.1,24.53 8.89,22.73 8.89,19.36 U1.3
USB1D_N
  Top 0.203: IC1.35 37.12,15.28 35.63,13.79 33.35,13.79 32.46,12.9 19.36,12.9 13.97,18.29 13.42,18.29 R3.2
USB1D_P
  Top 0.203: IC1.36 37.12,15.78 35.49,14.15 33.2,14.15 32.44,13.39 19.5,13.39 14.29,18.6 14.29,18.99 13.59,19.68
  Top 0.254: R2.2 9.65,20.19 10.16,19.68 13.59,19.68
VCAP_1
  Top 0.254: IC1.31 41.12,11.21 42.16,10.16 43.35,10.16 C9.2
  Top 0.305: 43.69,9.82 C9.2
VCAP_2
  Top 0.254: IC1.47 46.34,21.28 46.39,21.34 C11.1
VUSB  (via drill 0.33, 0.6)
  Top 0.203: 3.94,19.94 3.81,20.07
  Top 0.254: 3.94,19.94 3.94,18.41 | 3.81,17.91 U1.5
  Top 0.305: v50.55,14.73 50.49,14.78 48.59,14.78 48.39,14.99 47.12,14.99 46.91,14.78 IC1.34 | R5.1 9.06,33.87 11.3,31.62 v12.7,31.62 | USB2.1 4.92,25.18 4.7,25.4
  Top 0.406: 4.09,14.45 4.14,14.41 USB1.1 | 4.09,14.45 4.03,14.45 3.81,14.22 | 4.09,14.45 4,14.54
  Top 0.61: 9.56,27.18 9.53,27.16 VREG1.3 7.53,25.4 4.7,25.4 4.32,25.4 3.81,24.89 3.81,20.07 3.81,17.91 3.81,14.73 4,14.54 4.09,14.45 | 3.81,14.22 3.81,10.03 9.42,4.42 25.04,4.42 26.16,3.3 JP4.1 27.18,2.79 28.45,1.52 50.04,1.52 51.56,3.05 51.56,4.95 56.01,9.4 56.52,9.4 57.02,9.91 57.02,13.97 56.26,14.73 v55.88,14.73
  Top 0.813: 8.64,26.67 8.8,26.67 VREG1.3 | 9.56,27.18 9.65,27.18 | 9.65,27.18 10.41,27.18 12.7,29.46 v12.7,31.62 | 9.91,26.92 9.65,27.18 | C12.1 10.41,26.28 9.53,27.16
  Bottom 0.406: v55.88,14.73 v50.55,14.73
  Bottom 0.813: v12.7,31.62 14.99,33.91 27.05,33.91 JP1.1

### Text on the board
tNames: HydraBus http://hydrabus.com | (C) B.VERNOUX v1.0 Rev1_2+ | PC15 | PC14 | PC13 | PC12 | PC11 | PC10 | PC9 | PC8 | VUSB | PC0 | PC1 | PC2 | 3V3 | PC3 | SWCLK | PC4 | GND | PC5 | SWDIO | PC6 | NRST | PC7 | NC | SWD_DEBUG | PB6 | PB5 | PB7 | PB4 | PB8 | PB3 | PB9 | PB2 | PB10 | PB1 | ULED | PB11 | PB0 | UBTN | PA15 | BOOT0 | PD2 | PA12 | PA11 | PA10 | PA9 | PA8 | /BOOT DFU | VUSB | PA0 | PA1 | PA2 | PA3 | PA4 | PA5 | PA6 | PA7
bNames: PC12 | 5V | PC15 | PC14 | PC13 | PC11 | PC10 | PC9 | PC8 | 3V3 | GND | GND | PC0 | PC1 | PC2 | 3V3 | PC3 | PC4 | SWCLK | GND | PC5 | PC6 | SWDIO | PC7 | NRST | NC | SWD_DEBUG | GND | 3V3 | PB6 | PB5 | PB7 | PB4 | PB8 | PB3 | PB9 | PB2 | PB10 | PB1 | PB11 | PB0 | PA15 | BOOT0 | PD2 | PA12 | PA11 | PA10 | PA9 | PA8 | GND | GND | 5V | PA0 | PA1 | PA2 | PA3 | PA4 | PA5 | PA6 | PA7 | 3V3